# Altium project DMX Interface DB.PrjPcb (part 2 of 5)

## Sheet RP2040.SchDoc: RP2040
size B; SheetNumber: 10; SheetTotal: 14
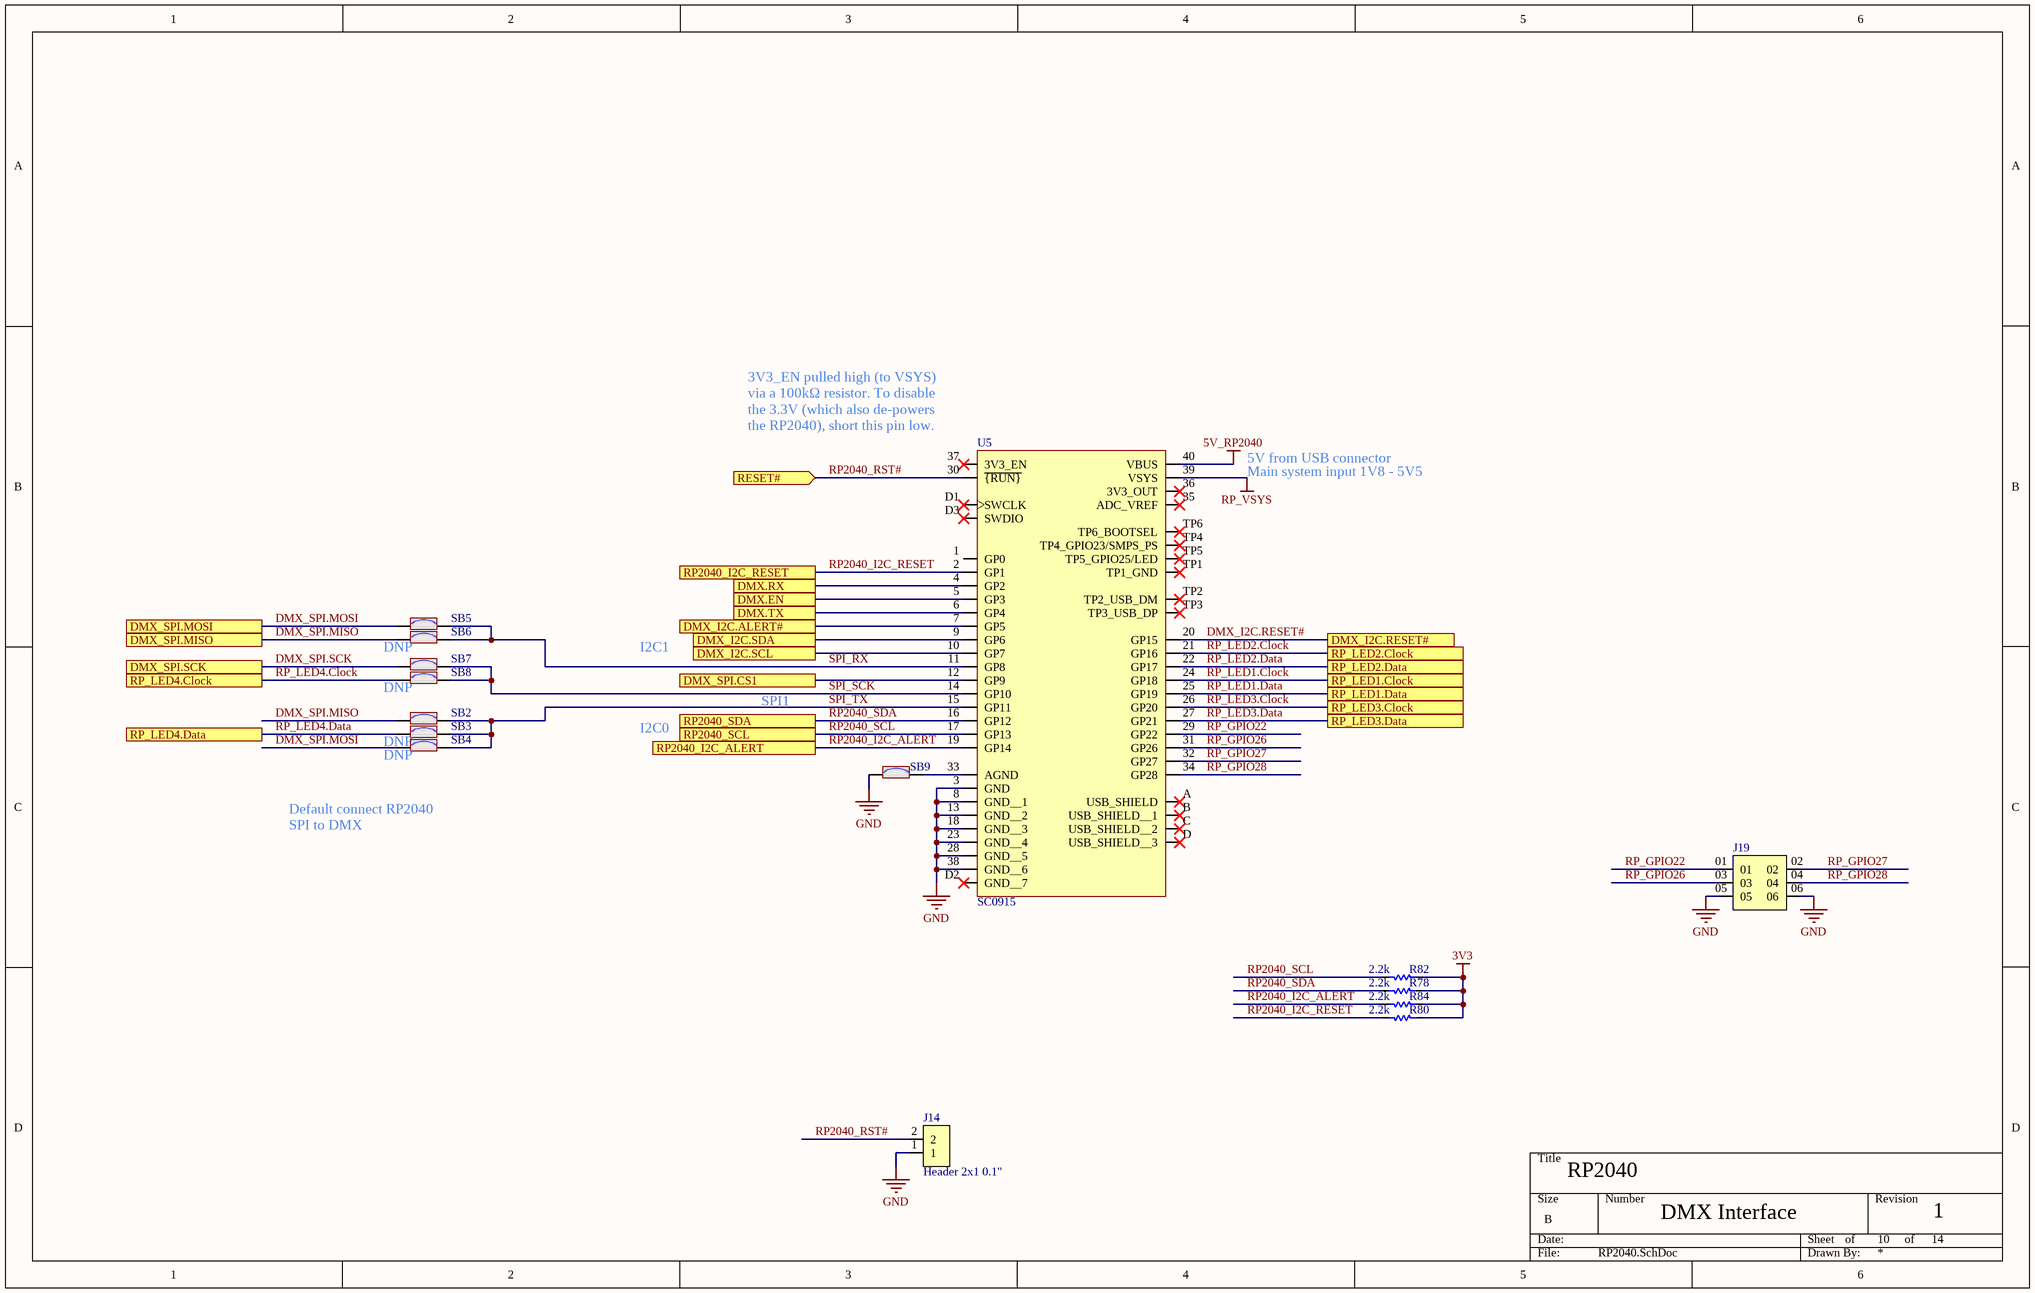
[diagram p3: RP2040.SchDoc]

### Parts
J14  Header 2x1 0.1"  [FP-M20-9990245-MFG]
J19  Header 3x2 0.1"  [HEADER 3x2 0.1 Through hole]  (value not drawn)
R78  value 2.2k  [RESC1608X06N_0603_MED]  (hidden comment: RC0603FR-072K2L)
R80  value 2.2k  [RESC1608X06N_0603_MED]  (hidden comment: RC0603FR-072K2L)
R82  value 2.2k  [RESC1608X06N_0603_MED]  (hidden comment: RC0603FR-072K2L)
R84  value 2.2k  [RESC1608X06N_0603_MED]  (hidden comment: RC0603FR-072K2L)
SB2  SolderBridge0603_On  [SOLDER-BRIDGE_R0603-0R-CLOSEMASK]  (value not drawn)
SB3  SolderBridge0603_On  [SOLDER-BRIDGE_R0603-0R-CLOSEMASK]  (value not drawn)
SB4  SolderBridge0603_On  [SOLDER-BRIDGE_R0603-0R-CLOSEMASK]  (value not drawn)
SB5  SolderBridge0603_On  [SOLDER-BRIDGE_R0603-0R-CLOSEMASK]  (value not drawn)
SB6  SolderBridge0603_On  [SOLDER-BRIDGE_R0603-0R-CLOSEMASK]  (value not drawn)
SB7  SolderBridge0603_On  [SOLDER-BRIDGE_R0603-0R-CLOSEMASK]  (value not drawn)
SB8  SolderBridge0603_On  [SOLDER-BRIDGE_R0603-0R-CLOSEMASK]  (value not drawn)
SB9  SolderBridge0603_On  [SOLDER-BRIDGE_R0603-0R]  (value not drawn)
U5  SC0915  [SC0915-Footprint-NoDEBUG]

### Ports
DMX.EN, DMX.RX, DMX.TX, DMX_I2C.ALERT#, DMX_I2C.RESET#, DMX_I2C.SCL, DMX_I2C.SDA, DMX_SPI.CS1, DMX_SPI.MISO, DMX_SPI.MOSI, DMX_SPI.SCK, RESET# (in), RP2040_I2C_ALERT, RP2040_I2C_RESET, RP2040_SCL, RP2040_SDA, RP_LED1.Clock, RP_LED1.Data, RP_LED2.Clock, RP_LED2.Data, RP_LED3.Clock, RP_LED3.Data, RP_LED4.Clock, RP_LED4.Data

### Nets
3V3: R78.2 R80.2 R82.2 R84.2
5V_RP2040: U5.40(VBUS)
GND: J14.1 J19.05 J19.06 SB9.1 U5.3(GND) U5.8(GND__1) U5.13(GND__2) U5.18(GND__3) U5.23(GND__4) U5.28(GND__5) U5.38(GND__6)
RP_VSYS: U5.39(VSYS)
DMX.EN: U5.5(GP3) ; port DMX.EN
DMX.RX: U5.4(GP2) ; port DMX.RX
DMX.TX: U5.6(GP4) ; port DMX.TX
DMX_I2C.ALERT#: U5.7(GP5) ; port DMX_I2C.ALERT#
DMX_I2C.RESET#: U5.20(GP15) ; port DMX_I2C.RESET#
DMX_I2C.SCL: U5.10(GP7) ; port DMX_I2C.SCL
DMX_I2C.SDA: U5.9(GP6) ; port DMX_I2C.SDA
DMX_SPI.CS1: U5.12(GP9) ; port DMX_SPI.CS1
DMX_SPI.MISO: SB2.1 SB6.1 ; port DMX_SPI.MISO
DMX_SPI.MOSI: SB4.1 SB5.1 ; port DMX_SPI.MOSI
DMX_SPI.SCK: SB7.1 ; port DMX_SPI.SCK
RP2040_I2C_ALERT: R84.1 U5.19(GP14) ; port RP2040_I2C_ALERT
RP2040_I2C_RESET: R80.1 U5.2(GP1) ; port RP2040_I2C_RESET
RP2040_RST#: J14.2 U5.30(~{{RUN}}) ; port RESET#
RP2040_SCL: R82.1 U5.17(GP13) ; port RP2040_SCL
RP2040_SDA: R78.1 U5.16(GP12) ; port RP2040_SDA
RP_GPIO22: J19.01 U5.29(GP22)
RP_GPIO26: J19.03 U5.31(GP26)
RP_GPIO27: J19.02 U5.32(GP27)
RP_GPIO28: J19.04 U5.34(GP28)
RP_LED1.Clock: U5.24(GP18) ; port RP_LED1.Clock
RP_LED1.Data: U5.25(GP19) ; port RP_LED1.Data
RP_LED2.Clock: U5.21(GP16) ; port RP_LED2.Clock
RP_LED2.Data: U5.22(GP17) ; port RP_LED2.Data
RP_LED3.Clock: U5.26(GP20) ; port RP_LED3.Clock
RP_LED3.Data: U5.27(GP21) ; port RP_LED3.Data
RP_LED4.Clock: SB8.1 ; port RP_LED4.Clock
RP_LED4.Data: SB3.1 ; port RP_LED4.Data
SPI_RX: SB5.2 SB6.2 U5.11(GP8)
SPI_SCK: SB7.2 SB8.2 U5.14(GP10)
SPI_TX: SB2.2 SB3.2 SB4.2 U5.15(GP11)
NetSB9_2: SB9.2 U5.33(AGND)

Not connected (* = marked no-connect by the designer): U5 1(GP0) 35(ADC_VREF)* 36(3V3_OUT)* 37(3V3_EN)* A(USB_SHIELD)* B(USB_SHIELD__1)* C(USB_SHIELD__2)* D(USB_SHIELD__3)* D1(SWCLK)* D2(GND__7)* D3(SWDIO)* TP1(TP1_GND)* TP2(TP2_USB_DM)* TP3(TP3_USB_DP)* TP4(TP4_GPIO23/SMPS_PS)* TP5(TP5_GPIO25/LED)* TP6(TP6_BOOTSEL)*

### Notes on the sheet
- (near U5) 3V3_EN pulled high (to VSYS) via a 100kΩ resistor. To disable the 3.3V (which also de-powers the RP2040), short this pin low.
- 5V from USB connector
- Main system input 1V8 - 5V5
- (near SB6) DNP
- (near SB8) DNP
- I2C1
- SPI1
- DNP
- (near SB4) DNP
- I2C0
- Default connect RP2040 SPI to DMX
- of

### Library data of the parts
J14 = CMP-002-00082-2: Conn Header Vert 2POS 2.54MM; Connector Type: BOARD CONNECTOR; Min Operating Temperature: -40°C; Mounting Technology: Through Hole; Pins: 2; Max Operating Temperature: 105°C; RoHS Compliant: Yes
J19 = CMP-002-00222-3: Board Connector Tall, 6 Contact(s), 2 Row(s), Male, Straight, 0.1 inch Pitch; Max Current Rating: 3A; Pins: 6; Connector Type: Header; Gender: Male; RoHS Compliant: Yes; Mounting Technology: Board
R78 R80 R82 R84 = CMP-009-00304-2: as R14 on sheet DMX; Min Operating Temperature: -55°C; Max Operating Temperature: 155°C; Tolerance: 1%; Case/Package: 0603; Pins: 2; Mounting Technology: Surface Mount; RoHS Compliant: Yes; JLCPN: C114662
SB2-SB9 = CMP-128-000020-6: Solder Bridge ON; Internal_Part_Number: MCD-00071; Manufacturer: YAGEO; Part_Type: Mechanical; Manufacturer_Part_Number: RC0603JR-070RL; Provided_By: SUBCO; ECCN_EU: n/a; Package: SB0603; ComponentLink1Description: Datasheet; Source: MB1404.SCHLIB; Status: Released; Design Item ID: SolderBridge0603_On; ComponentLink1URL: http://tunmcdsvn.tun.st.com/Component_Datasheet_Library/Trunk/Resistors/Yageo_Resistor_RC0603-series; ECCN_US: n/a; JLCPN: C100044
U5 = CMP-031-00011-4: RP2040 Pico ARM Cortex-M0+ - Microcontroller IC 32-Bit Dual-Core 133MHz; MF: Raspberry Pi; Case/Package: Pico; Design Item ID: SC0915